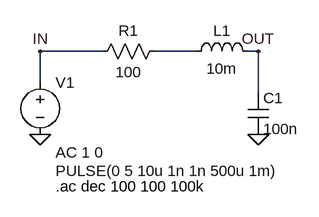
[diagram p0: schematic schematic.asc]
schematic.asc, the LTspice schematic file:
Version 4.1
SHEET 1 880 680
WIRE 192 32 96 32
WIRE 336 32 272 32
WIRE 432 32 416 32
WIRE 96 80 96 32
WIRE 432 96 432 32
FLAG 432 160 0
FLAG 96 160 0
FLAG 96 32 IN
FLAG 432 32 OUT
SYMBOL voltage 96 64 R0
WINDOW 3 24 152 Left 2
WINDOW 123 24 124 Left 2
WINDOW 39 0 0 Left 0
SYMATTR Value PULSE(0 5 10u 1n 1n 500u 1m)
SYMATTR Value2 AC 1 0
SYMATTR InstName V1
SYMBOL res 288 16 R90
WINDOW 0 0 56 VBottom 2
WINDOW 3 32 56 VTop 2
SYMATTR InstName R1
SYMATTR Value 100
SYMBOL ind 320 48 R270
WINDOW 0 32 56 VTop 2
WINDOW 3 5 56 VBottom 2
SYMATTR InstName L1
SYMATTR Value 10m
SYMATTR SpiceLine Rser=1m
SYMBOL cap 416 96 R0
SYMATTR InstName C1
SYMATTR Value 100n
TEXT 120 240 Left 2 !.ac dec 100 100 100k

The netlist it stands for:
* schematic.asc
V1 IN 0 PULSE(0 5 10u 1n 1n 500u 1m) AC 1 0
R1 N001 IN 100
L1 N001 OUT 10m Rser=1m
C1 OUT 0 100n
.ac dec 100 100 100k
.backanno
.end